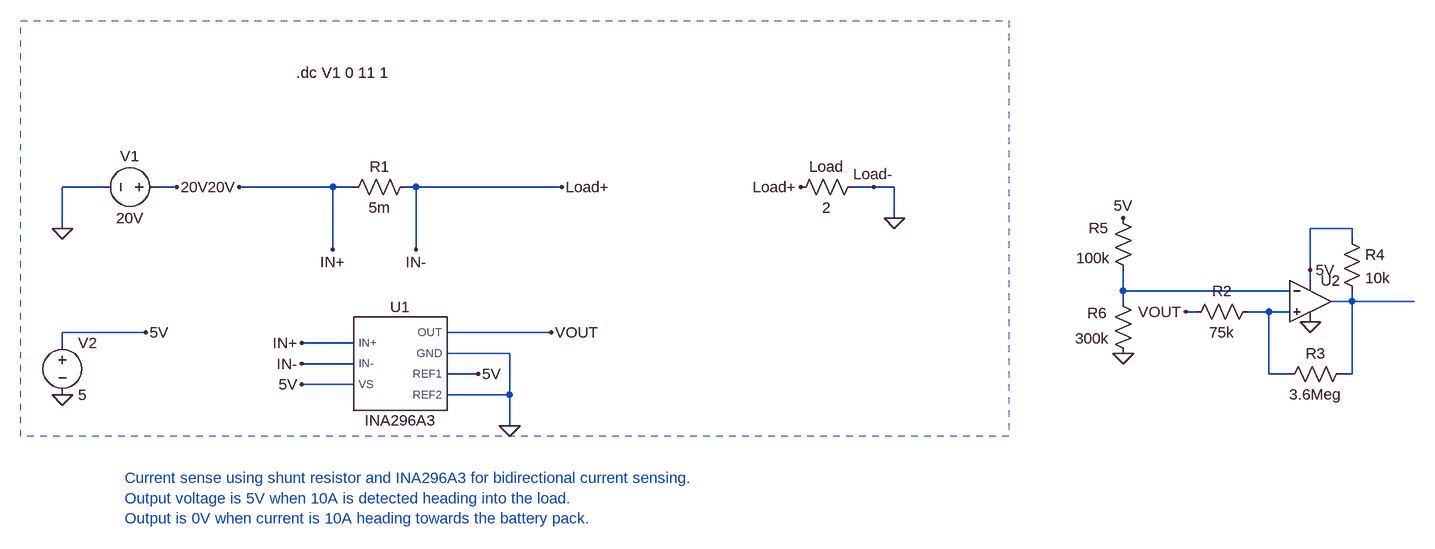
[diagram p0: schematic BMS Testing.asc]
BMS Testing.asc, the LTspice schematic file:
Version 4.1
SHEET 1 1660 680
WIRE -1136 -320 -1200 -320
WIRE -1024 -320 -1056 -320
WIRE -784 -320 -928 -320
WIRE -752 -320 -784 -320
WIRE -656 -320 -672 -320
WIRE -432 -320 -656 -320
WIRE 48 -320 16 -320
WIRE 80 -320 48 -320
WIRE 80 -272 80 -320
WIRE -1200 -256 -1200 -320
WIRE 784 -256 720 -256
WIRE 784 -240 784 -256
WIRE -784 -224 -784 -320
WIRE -656 -224 -656 -320
WIRE 720 -192 720 -256
WIRE 720 -176 720 -192
WIRE 432 -160 432 -192
WIRE 688 -160 432 -160
WIRE 432 -144 432 -160
WIRE 784 -144 784 -160
WIRE 784 -144 752 -144
WIRE 880 -144 784 -144
WIRE 544 -128 528 -128
WIRE 656 -128 624 -128
WIRE 688 -128 656 -128
WIRE -1072 -96 -1200 -96
WIRE -448 -96 -608 -96
WIRE -1200 -80 -1200 -96
WIRE -752 -80 -832 -80
WIRE -512 -64 -608 -64
WIRE -752 -48 -832 -48
WIRE -560 -32 -608 -32
WIRE 656 -32 656 -128
WIRE 688 -32 656 -32
WIRE 784 -32 784 -144
WIRE 784 -32 768 -32
WIRE -752 -16 -832 -16
WIRE -512 0 -512 -64
WIRE -512 0 -608 0
WIRE -512 48 -512 0
FLAG -1200 0 0
FLAG -512 48 0
FLAG -1200 -256 0
FLAG 80 -272 0
FLAG -448 -96 VOUT
FLAG -1024 -320 20V
FLAG -928 -320 20V
FLAG -1072 -96 5V
FLAG -832 -16 5V
FLAG -560 -32 5V
FLAG -784 -224 IN+
FLAG -832 -80 IN+
FLAG -832 -48 IN-
FLAG -656 -224 IN-
FLAG -64 -320 Load+
FLAG 48 -320 Load-
FLAG -432 -320 Load+
FLAG 720 -192 5V
FLAG 720 -112 0
FLAG 432 -64 0
FLAG 432 -272 5V
FLAG 528 -128 VOUT
SYMBOL res -656 -336 R90
WINDOW 0 0 56 VBottom 2
WINDOW 3 32 56 VTop 2
SYMATTR InstName R1
SYMATTR Value 5m
SYMBOL INA296A3 -688 -48 R0
SYMATTR InstName U1
SYMBOL voltage -1200 -96 R0
WINDOW 123 0 0 Left 0
WINDOW 39 0 0 Left 0
SYMATTR InstName V2
SYMATTR Value 5
SYMBOL voltage -1040 -320 R90
WINDOW 0 -32 56 VBottom 2
WINDOW 3 32 56 VTop 2
WINDOW 123 0 0 Left 0
WINDOW 39 -4 56 VBottom 2
SYMATTR InstName V1
SYMATTR Value 20V
SYMBOL res 32 -336 R90
WINDOW 0 0 56 VBottom 2
WINDOW 3 32 56 VTop 2
SYMATTR InstName Load
SYMATTR Value 2
SYMBOL OpAmps\\UniversalOpAmp2 720 -144 R0
SYMATTR InstName U2
SYMBOL res 640 -144 R90
WINDOW 0 0 56 VBottom 2
WINDOW 3 32 56 VTop 2
SYMATTR InstName R2
SYMATTR Value 75k
SYMBOL res 784 -48 R90
WINDOW 0 0 56 VBottom 2
WINDOW 3 32 56 VTop 2
SYMATTR InstName R3
SYMATTR Value 3.6Meg
SYMBOL res 768 -256 R0
SYMATTR InstName R4
SYMATTR Value 10k
SYMBOL res 416 -288 R0
WINDOW 0 -37 31 Left 2
WINDOW 3 -56 77 Left 2
SYMATTR InstName R5
SYMATTR Value 100k
SYMBOL res 416 -160 R0
WINDOW 0 -39 34 Left 2
WINDOW 3 -58 73 Left 2
SYMATTR InstName R6
SYMATTR Value 300k
TEXT -840 -496 Left 2 !.dc V1 0 11 1
TEXT -1104 128 Left 2 ;Current sense using shunt resistor and INA296A3 for bidirectional current sensing.\nOutput voltage is 5V when 10A is detected heading into the load.\nOutput is 0V when current is 10A heading towards the battery pack.
RECTANGLE Normal 256 64 -1264 -576 2

The netlist it stands for:
* BMS Testing.asc
R1 Load+ IN+ 5m
X§U1 IN+ Load+ 5V VOUT 0 5V 0 INA296A3  ; pins IN+ IN- VS OUT GND REF1 REF2
V2 5V 0 5
V1 IN+ 0 20V
R§Load 0 Load+ 2
X§U2 N003 N001 5V 0 N002 level2 Avol=1Meg GBW=10Meg Slew=10Meg Ilimit=25m Rail=0 Vos=0 En=0 Enk=0 In=0 Ink=0 Rin=500Meg  ; pins In+ In- V+ V- OUT
R2 N003 VOUT 75k
R3 N002 N003 3.6Meg
R4 5V N002 10k
R5 5V N001 100k
R6 N001 0 300k
.dc V1 0 11 1
* Current sense using shunt resistor and INA296A3 for bidirectional current sensing.
* Output voltage is 5V when 10A is detected heading into the load.
* Output is 0V when current is 10A heading towards the battery pack.
.lib C:\Users\mokoo\OneDrive\Documents\LTspice\BMS\INA296A3.lib
.lib UniversalOpAmp2.lib
.backanno
.end